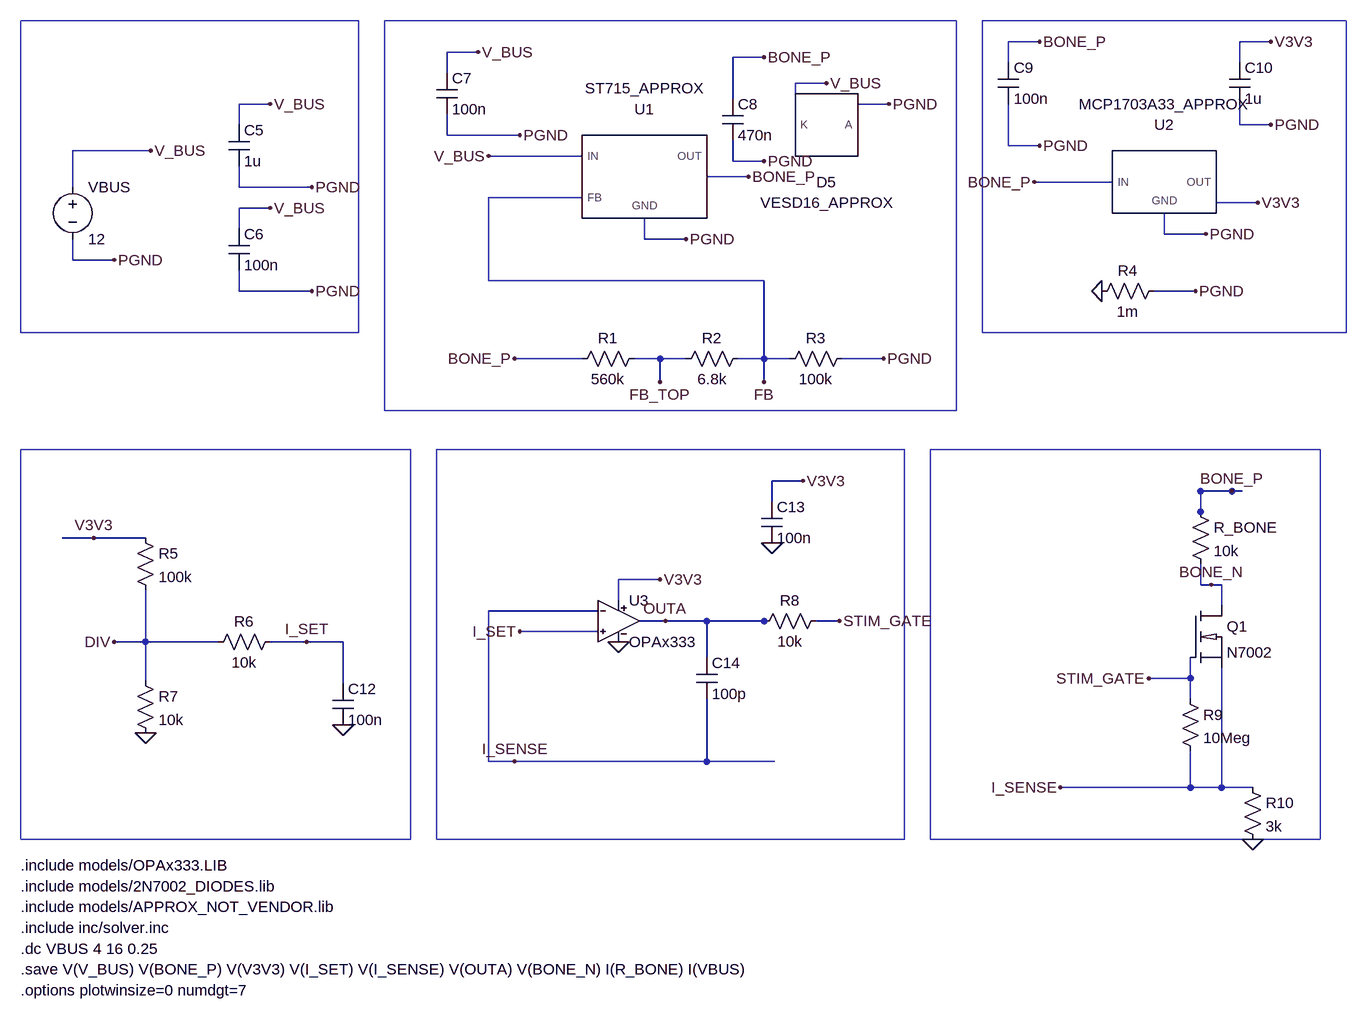
[diagram p0: schematic full_bus.asc]
full_bus.asc, the LTspice schematic file:
Version 4.1
SHEET 1 2200 1580
RECTANGLE Normal 100 100 620 580
SYMBOL voltage 180 340 R0
SYMATTR InstName VBUS
SYMATTR Value 12
WIRE 180 356 180 300
WIRE 180 300 300 300
FLAG 300 300 V_BUS
WIRE 180 436 180 468
WIRE 180 468 244 468
FLAG 244 468 PGND
SYMBOL cap 420 260 R0
SYMATTR InstName C5
SYMATTR Value 1u
WIRE 436 260 436 228
WIRE 436 228 484 228
FLAG 484 228 V_BUS
WIRE 436 324 436 356
WIRE 436 356 548 356
FLAG 548 356 PGND
SYMBOL cap 420 420 R0
SYMATTR InstName C6
SYMATTR Value 100n
WIRE 436 420 436 388
WIRE 436 388 484 388
FLAG 484 388 V_BUS
WIRE 436 484 436 516
WIRE 436 516 548 516
FLAG 548 516 PGND
RECTANGLE Normal 660 100 1540 700
SYMBOL ST715_APPROX 1060 340 R0
SYMATTR InstName U1
SYMATTR Value ST715_APPROX
WIRE 964 308 820 308
FLAG 820 308 V_BUS
WIRE 1156 308 1156 340
WIRE 1156 340 1220 340
FLAG 1220 340 BONE_P
WIRE 1060 404 1060 436
WIRE 1060 436 1124 436
FLAG 1124 436 PGND
SYMBOL cap 740 180 R0
SYMATTR InstName C7
SYMATTR Value 100n
WIRE 756 180 756 148
WIRE 756 148 804 148
FLAG 804 148 V_BUS
WIRE 756 244 756 276
WIRE 756 276 868 276
FLAG 868 276 PGND
SYMBOL cap 1180 220 R0
SYMATTR InstName C8
SYMATTR Value 470n
WIRE 1196 220 1196 156
WIRE 1196 156 1244 156
FLAG 1244 156 BONE_P
WIRE 1196 284 1196 316
WIRE 1196 316 1244 316
FLAG 1244 316 PGND
SYMBOL VESD16_APPROX 1340 260 R0
SYMATTR InstName D5
SYMATTR Value VESD16_APPROX
WIRE 1292 260 1292 196
WIRE 1292 196 1340 196
FLAG 1340 196 V_BUS
WIRE 1388 260 1388 228
WIRE 1388 228 1436 228
FLAG 1436 228 PGND
SYMBOL res 1060 604 R90
WINDOW 0 0 56 VBottom 2
WINDOW 3 32 56 VTop 2
SYMATTR InstName R1
SYMATTR Value 560k
SYMBOL res 1220 604 R90
WINDOW 0 0 56 VBottom 2
WINDOW 3 32 56 VTop 2
SYMATTR InstName R2
SYMATTR Value 6.8k
SYMBOL res 1380 604 R90
WINDOW 0 0 56 VBottom 2
WINDOW 3 32 56 VTop 2
SYMATTR InstName R3
SYMATTR Value 100k
WIRE 964 620 860 620
FLAG 860 620 BONE_P
WIRE 1044 620 1124 620
WIRE 1084 620 1084 656
FLAG 1084 656 FB_TOP
WIRE 1204 620 1284 620
WIRE 1244 620 1244 656
FLAG 1244 656 FB
WIRE 1364 620 1428 620
FLAG 1428 620 PGND
WIRE 1244 620 1244 500
WIRE 1244 500 820 500
WIRE 820 500 820 372
WIRE 820 372 964 372
RECTANGLE Normal 1580 100 2140 580
SYMBOL MCP1703A33_APPROX 1860 348 R0
SYMATTR InstName U2
SYMATTR Value MCP1703A33_APPROX
WIRE 1780 348 1660 348
FLAG 1660 348 BONE_P
WIRE 1940 348 1940 380
WIRE 1940 380 2004 380
FLAG 2004 380 V3V3
WIRE 1860 396 1860 428
WIRE 1860 428 1924 428
FLAG 1924 428 PGND
SYMBOL cap 1604 164 R0
SYMATTR InstName C9
SYMATTR Value 100n
WIRE 1620 164 1620 132
WIRE 1620 132 1668 132
FLAG 1668 132 BONE_P
WIRE 1620 228 1620 292
WIRE 1620 292 1668 292
FLAG 1668 292 PGND
SYMBOL cap 1960 164 R0
SYMATTR InstName C10
SYMATTR Value 1u
WIRE 1976 164 1976 132
WIRE 1976 132 2024 132
FLAG 2024 132 V3V3
WIRE 1976 228 1976 260
WIRE 1976 260 2024 260
FLAG 2024 260 PGND
SYMBOL res 1860 500 R90
WINDOW 0 0 56 VBottom 2
WINDOW 3 32 56 VTop 2
SYMATTR InstName R4
SYMATTR Value 1m
FLAG 1764 516 0
WIRE 1844 516 1908 516
FLAG 1908 516 PGND
RECTANGLE Normal 100 760 700 1360
SYMBOL res 276 880 R0
SYMATTR InstName R5
SYMATTR Value 100k
SYMBOL res 276 1100 R0
SYMATTR InstName R7
SYMATTR Value 10k
WIRE 292 976 292 1056
WIRE 292 1056 292 1116
WIRE 292 1056 244 1056
FLAG 244 1056 DIV
FLAG 292 1196 0
WIRE 292 896 276 896
WIRE 276 896 164 896
FLAG 212 896 V3V3
SYMBOL res 500 1040 R90
WINDOW 0 0 56 VBottom 2
WINDOW 3 32 56 VTop 2
SYMATTR InstName R6
SYMATTR Value 10k
WIRE 292 1056 404 1056
SYMBOL cap 580 1120 R0
SYMATTR InstName C12
SYMATTR Value 100n
WIRE 484 1056 596 1056
WIRE 596 1056 596 1120
FLAG 540 1056 I_SET
FLAG 596 1184 0
RECTANGLE Normal 740 760 1460 1360
SYMBOL OPAx333 1020 960 R0
SYMATTR InstName U3
SYMATTR Value OPAx333
WIRE 988 1040 868 1040
FLAG 868 1040 I_SET
WIRE 1020 992 1020 960
WIRE 1020 960 1084 960
FLAG 1084 960 V3V3
FLAG 1020 1056 0
SYMBOL cap 1240 840 R0
SYMATTR InstName C13
SYMATTR Value 100n
WIRE 1256 840 1256 808
WIRE 1256 808 1304 808
FLAG 1304 808 V3V3
FLAG 1256 904 0
WIRE 1052 1024 1156 1024
WIRE 1156 1024 1244 1024
FLAG 1092 1024 OUTA
SYMBOL cap 1140 1080 R0
SYMATTR InstName C14
SYMATTR Value 100p
WIRE 1156 1024 1156 1080
WIRE 1156 1144 1156 1240
SYMBOL res 1340 1008 R90
WINDOW 0 0 56 VBottom 2
WINDOW 3 32 56 VTop 2
SYMATTR InstName R8
SYMATTR Value 10k
WIRE 1244 1024 1244 1024
WIRE 1324 1024 1360 1024
FLAG 1360 1024 STIM_GATE
WIRE 988 1008 820 1008
WIRE 820 1008 820 1240
WIRE 820 1240 1156 1240
WIRE 1156 1240 1260 1240
FLAG 860 1240 I_SENSE
RECTANGLE Normal 1500 760 2100 1360
SYMBOL res 1900 840 R0
SYMATTR InstName R_BONE
SYMATTR Value 10k
WIRE 1916 856 1916 824
WIRE 1916 824 1964 824
FLAG 1964 824 BONE_P
SYMBOL N7002 1900 1000 R0
SYMATTR InstName Q1
SYMATTR Value N7002
WIRE 1916 936 1916 968
WIRE 1916 968 1948 968
WIRE 1948 968 1948 1000
FLAG 1932 968 BONE_N
WIRE 1900 1080 1900 1112
WIRE 1900 1112 1836 1112
FLAG 1836 1112 STIM_GATE
SYMBOL res 1884 1128 R0
SYMATTR InstName R9
SYMATTR Value 10Meg
WIRE 1900 1112 1900 1144
WIRE 1900 1224 1900 1280
WIRE 1948 1096 1948 1280
SYMBOL res 1980 1264 R0
SYMATTR InstName R10
SYMATTR Value 3k
FLAG 1996 1360 0
WIRE 1700 1280 1900 1280
WIRE 1900 1280 1948 1280
WIRE 1948 1280 1996 1280
FLAG 1700 1280 I_SENSE
WIRE 1916 856 1916 824
WIRE 1916 824 1980 824
TEXT 100 1400 Left 2 !.include models/OPAx333.LIB
TEXT 100 1432 Left 2 !.include models/2N7002_DIODES.lib
TEXT 100 1464 Left 2 !.include models/APPROX_NOT_VENDOR.lib
TEXT 100 1496 Left 2 !.include inc/solver.inc
TEXT 100 1528 Left 2 !.dc VBUS 4 16 0.25
TEXT 100 1560 Left 2 !.save V(V_BUS) V(BONE_P) V(V3V3) V(I_SET) V(I_SENSE) V(OUTA) V(BONE_N) I(R_BONE) I(VBUS)
TEXT 100 1592 Left 2 !.options plotwinsize=0 numdgt=7

The netlist it stands for:
* full_bus.asc
VBUS V_BUS PGND 12
C5 V_BUS PGND 1u
C6 V_BUS PGND 100n
X§U1 V_BUS BONE_P PGND FB ST715_APPROX  ; pins IN OUT GND FB
C7 V_BUS PGND 100n
C8 BONE_P PGND 470n
X§D5 V_BUS PGND VESD16_APPROX  ; pins K A
R1 FB_TOP BONE_P 560k
R2 FB FB_TOP 6.8k
R3 PGND FB 100k
X§U2 BONE_P V3V3 PGND MCP1703A33_APPROX  ; pins IN OUT GND
C9 BONE_P PGND 100n
C10 V3V3 PGND 1u
R4 PGND 0 1m
R5 V3V3 DIV 100k
R7 DIV 0 10k
R6 I_SET DIV 10k
C12 I_SET 0 100n
X§U3 OPAx333
C13 V3V3 0 100n
C14 OUTA I_SENSE 100p
R8 STIM_GATE OUTA 10k
R_BONE BONE_P BONE_N 10k
X§Q1 BONE_N STIM_GATE I_SENSE N7002  ; pins D G S
R9 STIM_GATE I_SENSE 10Meg
R10 I_SENSE 0 3k
.include models/OPAx333.LIB
.include models/2N7002_DIODES.lib
.include models/APPROX_NOT_VENDOR.lib
.include inc/solver.inc
.dc VBUS 4 16 0.25
.save V(V_BUS) V(BONE_P) V(V3V3) V(I_SET) V(I_SENSE) V(OUTA) V(BONE_N) I(R_BONE) I(VBUS)
.options plotwinsize=0 numdgt=7
.backanno
.end